# EAGLE design BatteryBoard_2.0 (EAGLE 8.4.1)
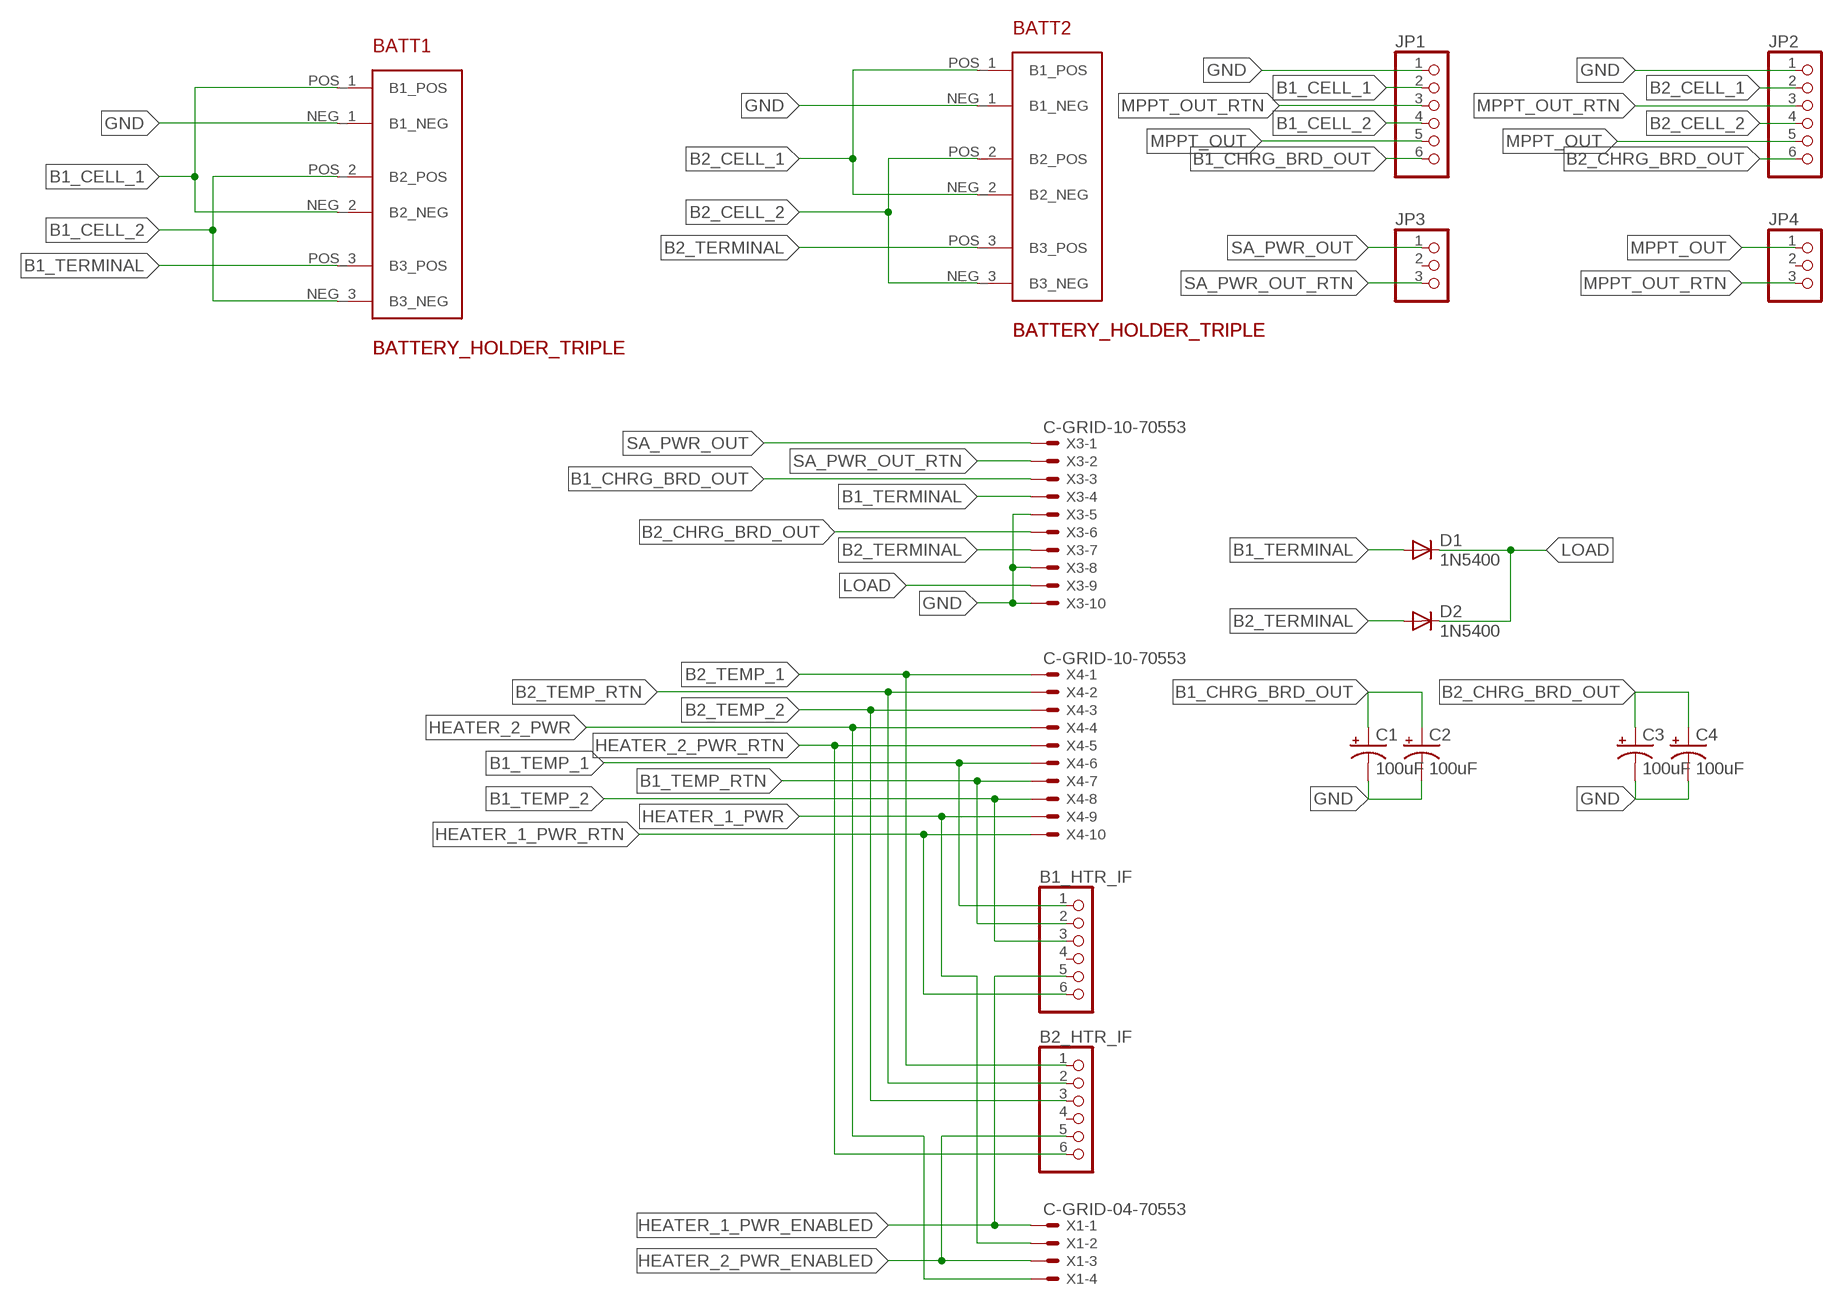
[diagram p0: schematic, sheet 1]

## Parts
B1_HTR_IF  PINHD-1X6CLEAN  [1X06-CLEAN]
B2_HTR_IF  PINHD-1X6CLEAN  [1X06-CLEAN]
BATT1  BATTERY_HOLDER_TRIPLE  [BATT_HOLDER_SINGLE]
BATT2  BATTERY_HOLDER_TRIPLE  [BATT_HOLDER_SINGLE]
C1  100uF  CPOL-USCT7343  [CT7343]
C2  100uF  CPOL-USCT7343  [CT7343]
C3  100uF  CPOL-USCT7343  [CT7343]
C4  100uF  CPOL-USCT7343  [CT7343]
D1  1N5400  [DO201-15]
D2  1N5400  [DO201-15]
JP1  PINHD-1X6CLEAN  [1X06-CLEAN]
JP2  PINHD-1X6CLEAN  [1X06-CLEAN]
JP3  PINHD-1X3  [1X03]
JP4  PINHD-1X3  [1X03]
X1  C-GRID-04-70553  [70553-04]
X3  C-GRID-10-70553  [70553-10]
X4  C-GRID-10-70553  [70553-10]

## Nets
B1_CELL_1 [PWR]: BATT1.NEG_2(B2_NEG) BATT1.POS_1(B1_POS) JP1.2
B1_CELL_2 [PWR]: BATT1.NEG_3(B3_NEG) BATT1.POS_2(B2_POS) JP1.4
B1_CHRG_BRD_OUT [PWR]: C1.+ C2.+ JP1.6 X3.3
B1_TEMP_1: B1_HTR_IF.1 X4.6
B1_TEMP_2: B1_HTR_IF.3 X4.8
B1_TEMP_RTN: B1_HTR_IF.2 X4.7
B1_TERMINAL [PWR]: BATT1.POS_3(B3_POS) D1.A X3.4
B2_CELL_1 [PWR]: BATT2.NEG_2(B2_NEG) BATT2.POS_1(B1_POS) JP2.2
B2_CELL_2 [PWR]: BATT2.NEG_3(B3_NEG) BATT2.POS_2(B2_POS) JP2.4
B2_CHRG_BRD_OUT [PWR]: C3.+ C4.+ JP2.6 X3.6
B2_TEMP_1: B2_HTR_IF.1 X4.1
B2_TEMP_2: B2_HTR_IF.3 X4.3
B2_TEMP_RTN: B2_HTR_IF.2 X4.2
B2_TERMINAL [PWR]: BATT2.POS_3(B3_POS) D2.A X3.7
GND [PWR]: BATT1.NEG_1(B1_NEG) BATT2.NEG_1(B1_NEG) C1.- C2.- C3.- C4.- JP1.1 JP2.1 X3.5 X3.8 X3.10
HEATER_1_PWR [PWR]: X1.2 X4.9
HEATER_1_PWR_ENABLED [PWR]: B1_HTR_IF.5 X1.1
HEATER_1_PWR_RTN [PWR]: B1_HTR_IF.6 X4.10
HEATER_2_PWR [PWR]: X1.4 X4.4
HEATER_2_PWR_ENABLED [PWR]: B2_HTR_IF.5 X1.3
HEATER_2_PWR_RTN [PWR]: B2_HTR_IF.6 X4.5
LOAD [PWR]: D1.C D2.C X3.9
MPPT_OUT [PWR]: JP1.5 JP2.5 JP4.1
MPPT_OUT_RTN [PWR]: JP1.3 JP2.3 JP4.3
SA_PWR_OUT [PWR]: JP3.1 X3.1
SA_PWR_OUT_RTN [PWR]: JP3.3 X3.2
Unconnected: B1_HTR_IF.4 B2_HTR_IF.4 JP3.2 JP4.2

## Library data of the parts
B1_HTR_IF B2_HTR_IF JP1 JP2 = adafruit:PINHD-1X6: PIN HEADER
BATT1 BATT2 = Battery_Holder_Triple:BATTERY_HOLDER_TRIPLE
C1-C4 = adafruit:CPOL-US: POLARIZED CAPACITOR, American symbol
D1 D2 = diode:1N5400: DIODE standard rectifier, 3 A, 50 V (Motorola)
JP3 JP4 = adafruit:PINHD-1X3: PIN HEADER
X1 = con-molex:C-GRID-04: CONNECTOR wire to board 2.54 mm (0.100") pitch header; OC_FARNELL: unknown; OC_NEWARK: unknown
X3 X4 = con-molex:C-GRID-10: CONNECTOR wire to board 2.54 mm (0.100") pitch header; OC_FARNELL: unknown; OC_NEWARK: unknown

## Net classes
0 default: width 0.305 mm, drill 0.508 mm, clearance 0.254 mm
1 PWR: width 0.457 mm, drill 0.508 mm, clearance 0.356 mm

## Board
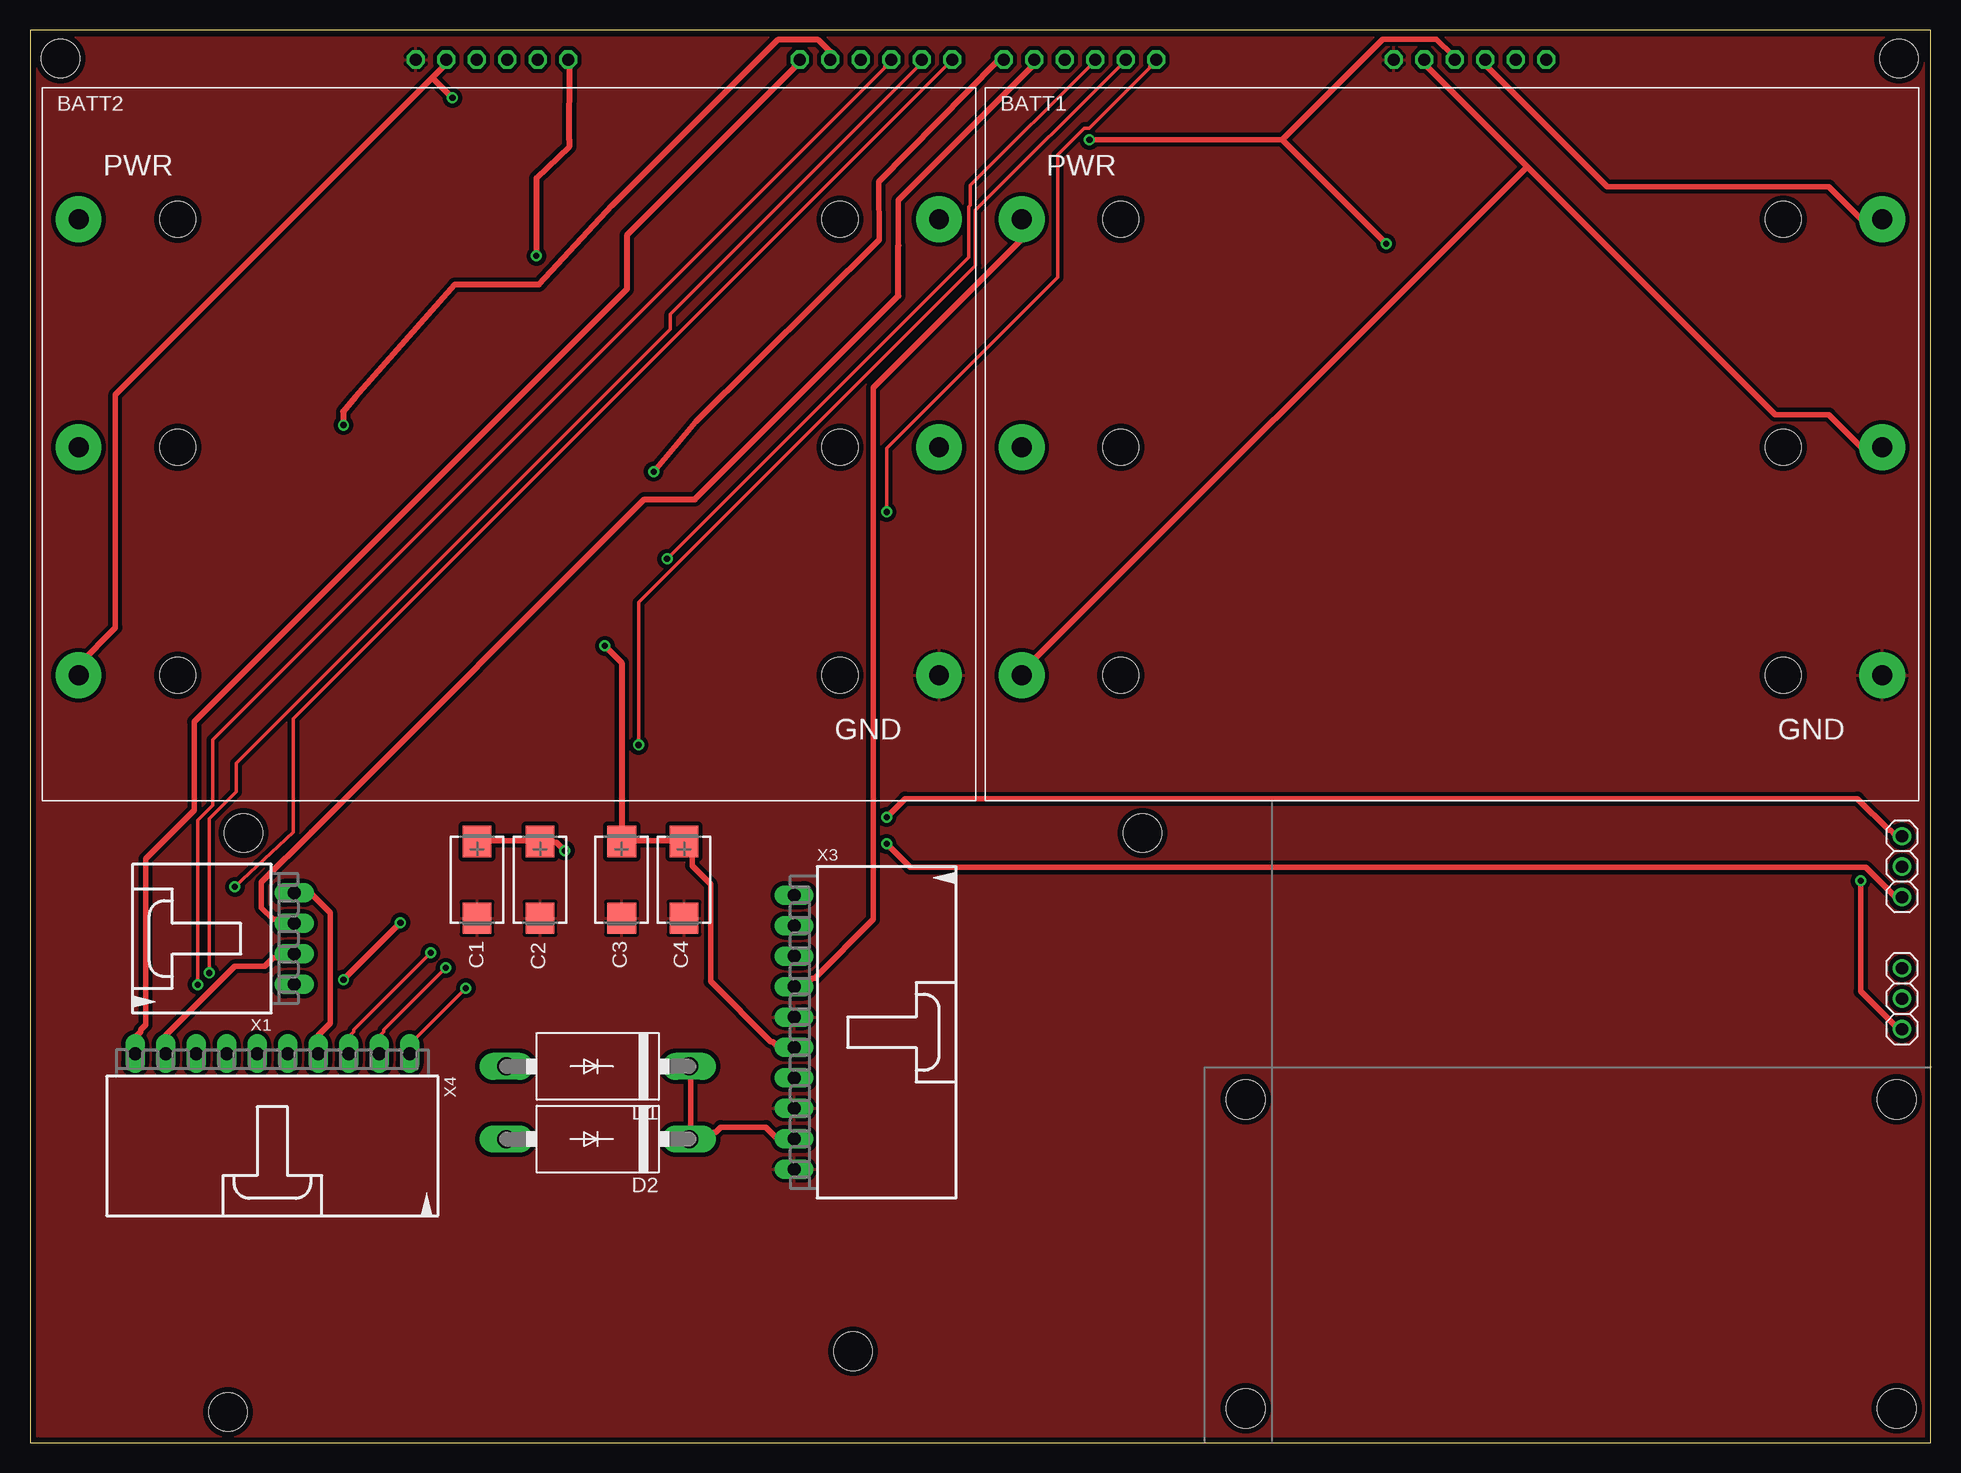
[diagram p1: board, top side]
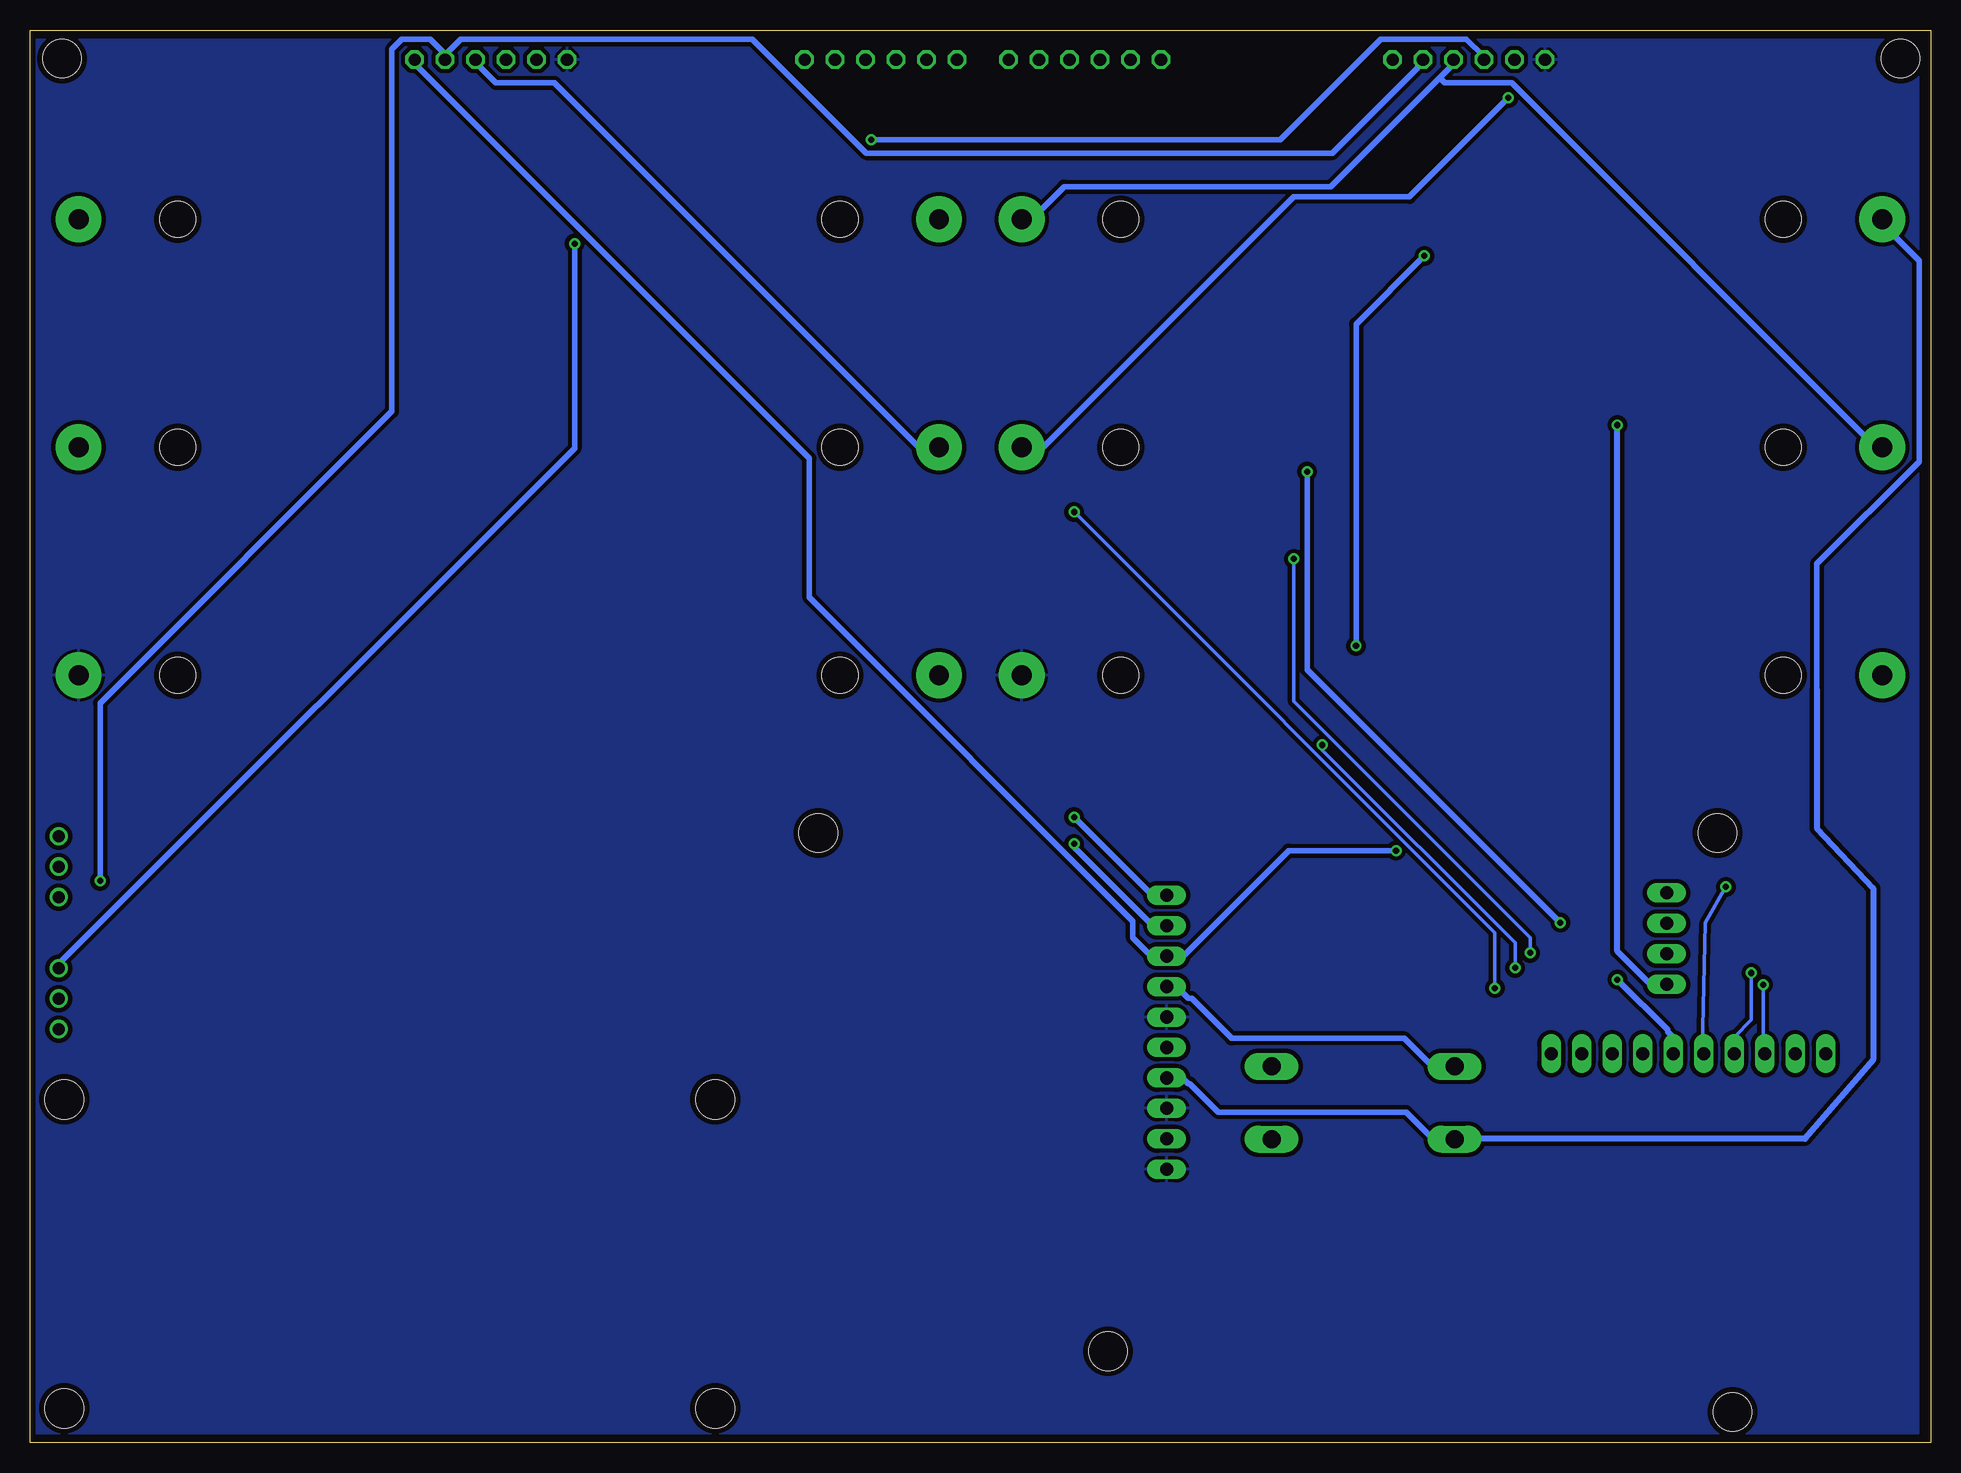
[diagram p2: board, bottom side, seen from below]

Size 158.4 x 117.72 mm. Coordinates in mm from the lower left corner, seen from the top.
Outline: 0,0 158.4,0 158.4,117.72 0,117.72 0,0
Copper layers (1*16): Top 0.035mm / dielectric 2mm / Bottom 0.035mm
Design rules "default *": minimum track width 6mil, minimum drill 0.35mm, track to track 6mil, track to pad 6mil, pad to pad 6mil, via to via 6mil, smd to smd 6mil, copper to edge 18mil, drill to drill 6mil, minimum pad ring 10mil, minimum via ring 8mil, stop-mask expansion 4mil, vias tented up to drill 0mil, thermal gap 10mil
Holes 3.2 mm at 2.54,115.33 155.74,115.33 16.51,2.54 68.58,7.62 92.71,50.8 17.78,50.8
Holes 3.25 mm at 155.55,2.85 101.3,28.6 155.55,28.6 101.3,2.85

### Footprints (pad centres in the part's own frame; a part is rotated, then mirrored left to right if it is on the bottom)
1X06-CLEAN = drill 1.016 octagon: 1 -6.35,0; 2 -3.81,0; 3 -1.27,0; 4 1.27,0; 5 3.81,0; 6 6.35,0
BATT_HOLDER_SINGLE = drill 1.65 pad 3.81: NEG_1 74.75,10.45; NEG_2 74.75,29.45; NEG_3 74.75,48.45; POS_1 3.05,10.45; POS_2 3.05,29.45; POS_3 3.05,48.45 | hole 3: 11.3,10.45; 66.5,10.45; 11.3,29.45; 66.5,29.45; 11.3,48.45; 66.5,48.45
CT7343 = smd 2.6 x 2.4: + 3.2,0; - -3.2,0
DO201-15 = drill 1.499 long: A 7.62,0; C -7.62,0
1X03 = drill 1.016: 1 -2.54,0; 2 0,0; 3 2.54,0
70553-04 = drill 1.092 long: 1 -3.81,-7.62; 2 -1.27,-7.62; 3 1.27,-7.62; 4 3.81,-7.62
70553-10 = drill 1.092 long: 1 -11.43,-7.62; 2 -8.89,-7.62; 3 -6.35,-7.62; 4 -3.81,-7.62; 5 -1.27,-7.62; 6 1.27,-7.62; 7 3.81,-7.62; 8 6.35,-7.62; 9 8.89,-7.62; 10 11.43,-7.62

### Placement (x,y rotation side)
B1_HTR_IF  70.5,115.25 180 top
B2_HTR_IF  87.5,115.25 180 top
BATT1  79.6,53.5 0 top
BATT2  1,53.5 0 top
C1  37.25,46.9 90 top
C2  42.5,46.9 90 top
C3  49.3,46.9 90 top
C4  54.5,46.9 90 top
D1  47.31,31.35 180 top
D2  47.31,25.3 180 top
JP1  120,115.25 0 top
JP2  38.5,115.25 0 top
JP3  156,48 270 top
JP4  156,37 90 top
X1  14.4,42 90 top
X3  71.3,34.2 270 top
X4  20.2,24.8 180 top

### Tracks (layer width: path | path; a pad name or v marks a point on that pad's centre or on a via)
B1_CELL_1
  Top 0.457: 124.75,106.33 145.43,85.66 149.9,85.66 152.55,83 154.23,83 BATT1.NEG_2 | 124.75,106.33 116.23,114.86 116.23,115.14 JP1.2 | 124.75,106.33 82.7,64.28 82.7,64 BATT1.POS_1
B1_CELL_2
  Top 0.457: JP1.4 121.4,115.14 121.4,114.72 131.46,104.66 149.9,104.66 152.55,102 154.23,102 BATT1.NEG_3
  Bottom 0.457: BATT1.POS_2 82.7,83 84.38,83 114.69,113.32 119.58,113.32 121.4,115.14 JP1.4
B1_CHRG_BRD_OUT  (via drill 0.51)
  Top 0.457: C1.+ 37.3,50.17 42.47,50.17 C2.+ 42.61,50.03 43.87,50.03 v44.56,49.34
  Bottom 0.457: JP1.6 126.29,115.14 126.29,114.86 93.46,82.03 93.46,70.43 66.5,43.47 66.5,42.07 65.1,40.68 63.7,40.68 X3.3 63.56,40.68 62.17,40.68 53.51,49.34 v44.56,49.34
B1_TEMP_1  (via drill 0.51)
  Top 0.305: v17.08,46.32 21.93,50.87 21.93,60.33 B1_HTR_IF.1 76.83,115.28
  Bottom 0.305: v17.08,46.32 18.78,43.31 19,34.53 19,32.43 X4.6
B1_TEMP_2  (via drill 0.51)
  Top 0.305: v13.97,38.16 13.97,51.85 15.23,53.11 15.23,58.56 71.25,114.58 71.25,114.72 71.67,115.14 B1_HTR_IF.3
  Bottom 0.305: v13.97,38.16 13.97,32.43 X4.8
B1_TEMP_RTN  (via drill 0.51)
  Top 0.305: v14.95,39.14 14.95,51.99 17.18,54.23 17.18,56.6 53.37,92.78 53.37,94.04 74.18,114.86 74.18,115.14 B1_HTR_IF.2
  Bottom 0.305: v14.95,39.14 14.95,35.23 16.34,33.83 16.34,32.43 X4.7
B1_TERMINAL
  Top 0.457: BATT1.POS_3 82.56,101.86 82.56,100.19 70.27,87.89 70.27,43.61 65.38,38.72 65.24,38.72 64.54,38.02 63.7,38.02 X3.4
  Bottom 0.457: X3.4 63.56,37.88 62.73,37.88 61.89,37.04 61.61,37.04 58.26,33.69 43.87,33.69 41.63,31.45 39.81,31.45 D1.A
B2_CELL_1  (via drill 0.51)
  Top 0.457: 33.53,113.74 7.12,87.33 7.12,67.92 4.05,64.84 4.05,64 BATT2.POS_1 | 33.53,113.74 34.65,114.86 34.65,115.14 JP2.2 | 33.53,113.74 v35.2,112.06
  Bottom 0.457: v35.2,112.06 43.45,103.82 53.09,103.82 73.9,83 75.72,83 BATT2.NEG_2
B2_CELL_2
  Bottom 0.457: 40.93,113.74 50.01,104.66 72.22,104.66 74.88,102 75.72,102 BATT2.NEG_3 | 40.93,113.74 39.81,114.86 39.81,115.14 JP2.4 | 40.93,113.74 40.51,113.32 34.92,113.32 4.61,83 4.05,83 BATT2.POS_2
B2_CHRG_BRD_OUT  (via drill 0.51 pad 0.91)
  Top 0.457: 44.98,114.72 44.98,115.14 JP2.6 | 48.62,50.87 49.17,50.31 C3.+ 49.31,50.17 54.48,50.17 C4.+ 54.62,49.9 55.18,49.34 55.18,48.08 56.72,46.54 56.72,38.44 61.75,33.41 61.89,33.41 62.31,32.99 63.56,32.99 X3.6 | v47.9,66.4 49.3,65
  Top 0.508: 44.98,114.72 44.92,108.61 44.92,107.99 42.2,105.37 v42.2,98.9 | 49.3,65 C3.+
  Bottom 0.457: v42.2,98.9 47.9,93.2 v47.9,66.4
B2_TEMP_1  (via drill 0.51)
  Top 0.305: v71.39,77.56 71.39,82.87 85.64,97.11 85.64,107.31 87.87,109.55 88.29,109.55 93.32,114.58 93.32,114.72 93.74,115.14 B2_HTR_IF.1 | v36.32,37.88 31.71,33.27 31.71,32.43 X4.1
  Bottom 0.305: v71.39,77.56 36.32,42.49 v36.32,37.88
B2_TEMP_2  (via drill 0.51)
  Top 0.305: v53.09,73.65 78.23,98.79 78.23,102.98 78.37,103.12 78.37,104.8 88.71,115.14 B2_HTR_IF.3 | v33.39,40.81 26.96,34.39 26.96,34.25 26.68,33.97 26.68,32.43 X4.3
  Bottom 0.305: v53.09,73.65 53.09,61.77 33.39,42.07 v33.39,40.81
B2_TEMP_RTN  (via drill 0.51)
  Top 0.305: v50.71,58.14 50.71,70.01 78.79,98.09 78.79,102.7 91.22,115.14 B2_HTR_IF.2 | v34.65,39.56 29.48,34.39 29.48,34.25 29.2,33.97 29.2,32.43 X4.2
  Bottom 0.305: v50.71,58.14 50.71,57.72 34.65,41.65 v34.65,39.56
B2_TERMINAL
  Bottom 0.457: X3.7 63.56,30.34 62.31,30.34 61.89,29.92 61.75,29.92 59.37,27.54 43.73,27.54 41.49,25.31 39.81,25.31 D2.A | 9.5,62.75 9.5,73.23 0.98,81.75 0.98,98.51 3.91,101.44 3.91,101.86 BATT2.POS_3
  Bottom 0.508: 9.5,62.75 9.5,51.2 4.8,46.2 4.8,31.9 10.49,25.31 39.81,25.31
GND
  pour Top: 0.6,0.5 0.6,117.1 8.8,117.1 158.2,117.1 158.2,0.5 0.8,0.5 0.8,0.6
  pour Bottom: 1,1.1 1,116.9 1.2,116.9 158,116.9 158,0.8 1,0.8
HEATER_1_PWR
  Top 0.457: X4.9 11.32,32.43 11.32,33.97 17.04,39.7 19.56,39.7 20.26,40.4 20.54,40.4 20.82,40.68 21.93,40.68 X1.2
HEATER_1_PWR_ENABLED  (via drill 0.51 pad 0.91)
  Top 0.508: B1_HTR_IF.5 66.69,115.91 65.7,116.9 62.3,116.9 48.5,103.1 42.4,96.5 35.4,96.5 27.1,87.1 26.1,85.92 v26.12,84.8
  Bottom 0.457: 23.47,38.3 26.12,40.95
  Bottom 0.508: X1.1 23.36,38.19 23.47,38.3 | 26.12,40.95 v26.12,84.8
HEATER_1_PWR_RTN
  Top 0.457: 63.7,114.58 63.7,114.72 64.12,115.14 B1_HTR_IF.6 | 13.69,60.09 13.69,52.69 9.64,48.64 9.64,34.81 9.22,34.39 9.22,34.25 8.8,33.83 8.8,32.43 X4.10
  Top 0.508: 63.7,114.58 49.73,100.61 49.73,96.14 13.69,60.09
HEATER_2_PWR
  Top 0.457: X4.4 24.03,32.43 24.03,33.97 25.01,34.95 25.01,44.17 23.47,45.7 22.07,45.7 X1.4
HEATER_2_PWR_ENABLED
  Top 0.457: 72.37,99.77 72.37,103.55 83.68,114.86 83.68,115.14 B2_HTR_IF.5 | 23.47,50.87 19.28,46.68 19.28,44.59 20.26,43.61 20.54,43.61 20.82,43.33 21.93,43.33 X1.3
  Top 0.508: 23.47,50.87 51.2,78.6 55.4,78.6 72.37,95.57 72.37,99.77
HEATER_2_PWR_RTN  (via drill 0.51)
  Top 0.457: v51.97,80.91 55.47,85.07 70.76,100.26 70.73,105.06 80.61,115.14 81.03,115.14 B2_HTR_IF.6
  Top 0.508: v26.12,38.58 v30.87,43.33
  Bottom 0.457: v51.97,80.91 51.97,64.42 v30.87,43.33 | v26.12,38.58 21.93,34.39 21.93,34.25 21.51,33.83 21.51,32.43 X4.5
LOAD
  Top 0.457: X3.9 63.56,25.45 62.17,25.45 61.33,26.29 57.56,26.29 57.14,25.87 57,25.87 56.44,25.31 55.04,25.31 D2.C 55.04,25.45 55.04,31.32 D1.C
MPPT_OUT  (via drill 0.51)
  Top 0.457: v152.55,46.82 152.55,37.6 155.63,34.53 155.91,34.53 JP4.1
  Bottom 0.457: JP2.5 42.33,115.14 42.75,114.72 42.75,114.58 49.87,107.45 88.71,107.45 98.21,116.95 122.52,116.95 123.77,115.69 123.77,115.28 JP1.5 123.91,115.83 125.03,116.95 127.41,116.95 128.25,116.11 128.25,85.94 152.55,61.63 v152.55,46.82
MPPT_OUT_RTN  (via drill 0.51)
  Top 0.457: 104.36,108.57 v88.29,108.57 | 104.36,108.57 112.74,116.95 117.21,116.95 118.61,115.56 118.61,115.28 JP1.3 | 104.36,108.57 v113.02,99.91
  Bottom 0.457: v88.29,108.57 54.2,108.57 45.82,116.95 38.7,116.95 37.3,115.56 37.3,115.28 JP2.3 | v113.02,99.91 113.02,82.87 155.91,39.98 155.91,39.56 JP4.3
SA_PWR_OUT  (via drill 0.51)
  Top 0.457: v71.39,52.13 72.92,53.67 152.27,53.67 154.93,51.01 155.07,51.01 155.49,50.59 155.91,50.59 JP3.1
  Bottom 0.457: v71.39,52.13 64.96,45.7 63.7,45.7 X3.1
SA_PWR_OUT_RTN  (via drill 0.51)
  Top 0.457: v71.39,49.9 73.34,47.94 152.97,47.94 155.35,45.56 155.91,45.56 JP3.3
  Bottom 0.457: v71.39,49.9 71.39,49.62 64.96,43.19 63.7,43.19 X3.2

### Text on the board
tDocu: B1 Charge Control | B2 Charge Control | RB Hole | ARD Hole | ARD Hole | MPPT IN | MPPT OUT | MPPT Hole | MPPT Hole | SYSTEM POWER INTERFACE | MPPT | HEATER POWER INTERFACE | ARD Hole | MPPT Hole | MPPT + Gyro Hole | ARD Hole
bDocu: B1 Heater Set | B2 Heater Set | BATT 1 | BATT2 | POS | POS | NEG | NEG | AlphaNewt Battery Board v2.0